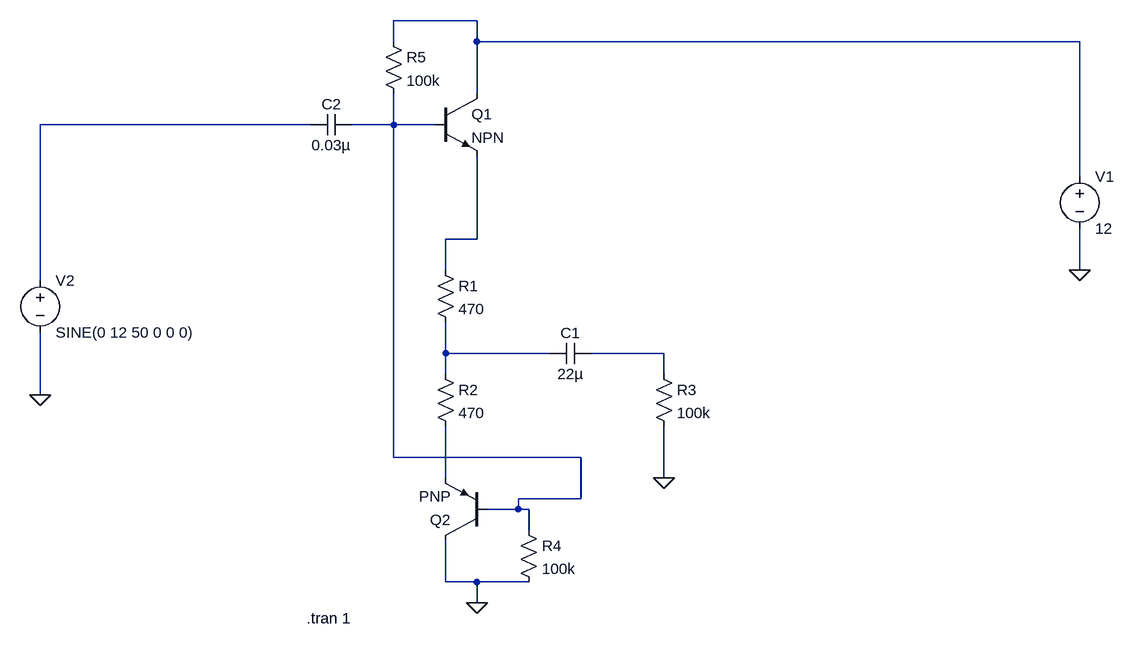
[diagram p0: schematic Draft2.asc]
Draft2.asc, the LTspice schematic file:
Version 4
SHEET 1 1256 728
WIRE 272 -208 144 -208
WIRE 144 -176 144 -208
WIRE 272 -176 272 -208
WIRE 1200 -176 272 -176
WIRE 272 -96 272 -176
WIRE 16 -48 -400 -48
WIRE 144 -48 144 -96
WIRE 144 -48 80 -48
WIRE 208 -48 144 -48
WIRE 1200 32 1200 -176
WIRE 272 128 272 0
WIRE 272 128 224 128
WIRE 224 176 224 128
WIRE 1200 176 1200 112
WIRE -400 192 -400 -48
WIRE 224 304 224 256
WIRE 384 304 224 304
WIRE 560 304 448 304
WIRE 224 336 224 304
WIRE 560 336 560 304
WIRE -400 368 -400 272
WIRE 144 464 144 -48
WIRE 432 464 144 464
WIRE 224 496 224 416
WIRE 560 496 560 416
WIRE 432 528 432 464
WIRE 432 528 336 528
WIRE 336 544 336 528
WIRE 336 544 288 544
WIRE 352 544 336 544
WIRE 352 576 352 544
WIRE 224 656 224 592
WIRE 272 656 224 656
WIRE 352 656 272 656
WIRE 272 688 272 656
FLAG 560 496 0
FLAG 272 688 0
FLAG 1200 176 0
FLAG -400 368 0
SYMBOL npn 208 -96 R0
SYMATTR InstName Q1
SYMBOL pnp 288 592 R180
SYMATTR InstName Q2
SYMBOL cap 448 288 R90
WINDOW 0 0 32 VBottom 2
WINDOW 3 32 32 VTop 2
SYMATTR InstName C1
SYMATTR Value 22µ
SYMBOL res 208 160 R0
SYMATTR InstName R1
SYMATTR Value 470
SYMBOL res 208 320 R0
SYMATTR InstName R2
SYMATTR Value 470
SYMBOL cap 80 -64 R90
WINDOW 0 0 32 VBottom 2
WINDOW 3 32 32 VTop 2
SYMATTR InstName C2
SYMATTR Value 0.03µ
SYMBOL res 544 320 R0
SYMATTR InstName R3
SYMATTR Value 100k
SYMBOL voltage 1200 16 R0
WINDOW 123 0 0 Left 0
WINDOW 39 0 0 Left 0
SYMATTR InstName V1
SYMATTR Value 12
SYMBOL res 336 560 R0
SYMATTR InstName R4
SYMATTR Value 100k
SYMBOL res 128 -192 R0
SYMATTR InstName R5
SYMATTR Value 100k
SYMBOL voltage -400 176 R0
WINDOW 123 0 0 Left 0
WINDOW 39 0 0 Left 0
SYMATTR InstName V2
SYMATTR Value SINE(0 12 50 0 0 0)
TEXT 10 712 Left 2 !.tran 1

The netlist it stands for:
* Draft2.asc
Q1 N001 N003 N004 0 NPN
Q2 0 N003 N007 0 PNP
C1 N006 N005 22µ
R1 N004 N005 470
R2 N005 N007 470
C2 N003 N002 0.03µ
R3 N006 0 100k
V1 N001 0 12
R4 N003 0 100k
R5 N001 N003 100k
V2 N002 0 SINE(0 12 50 0 0 0)
.model NPN NPN
.model PNP PNP
.lib standard.bjt
.tran 1
.backanno
.end